# EAGLE design FBMiniLEDStrip (EAGLE 7.7.0)
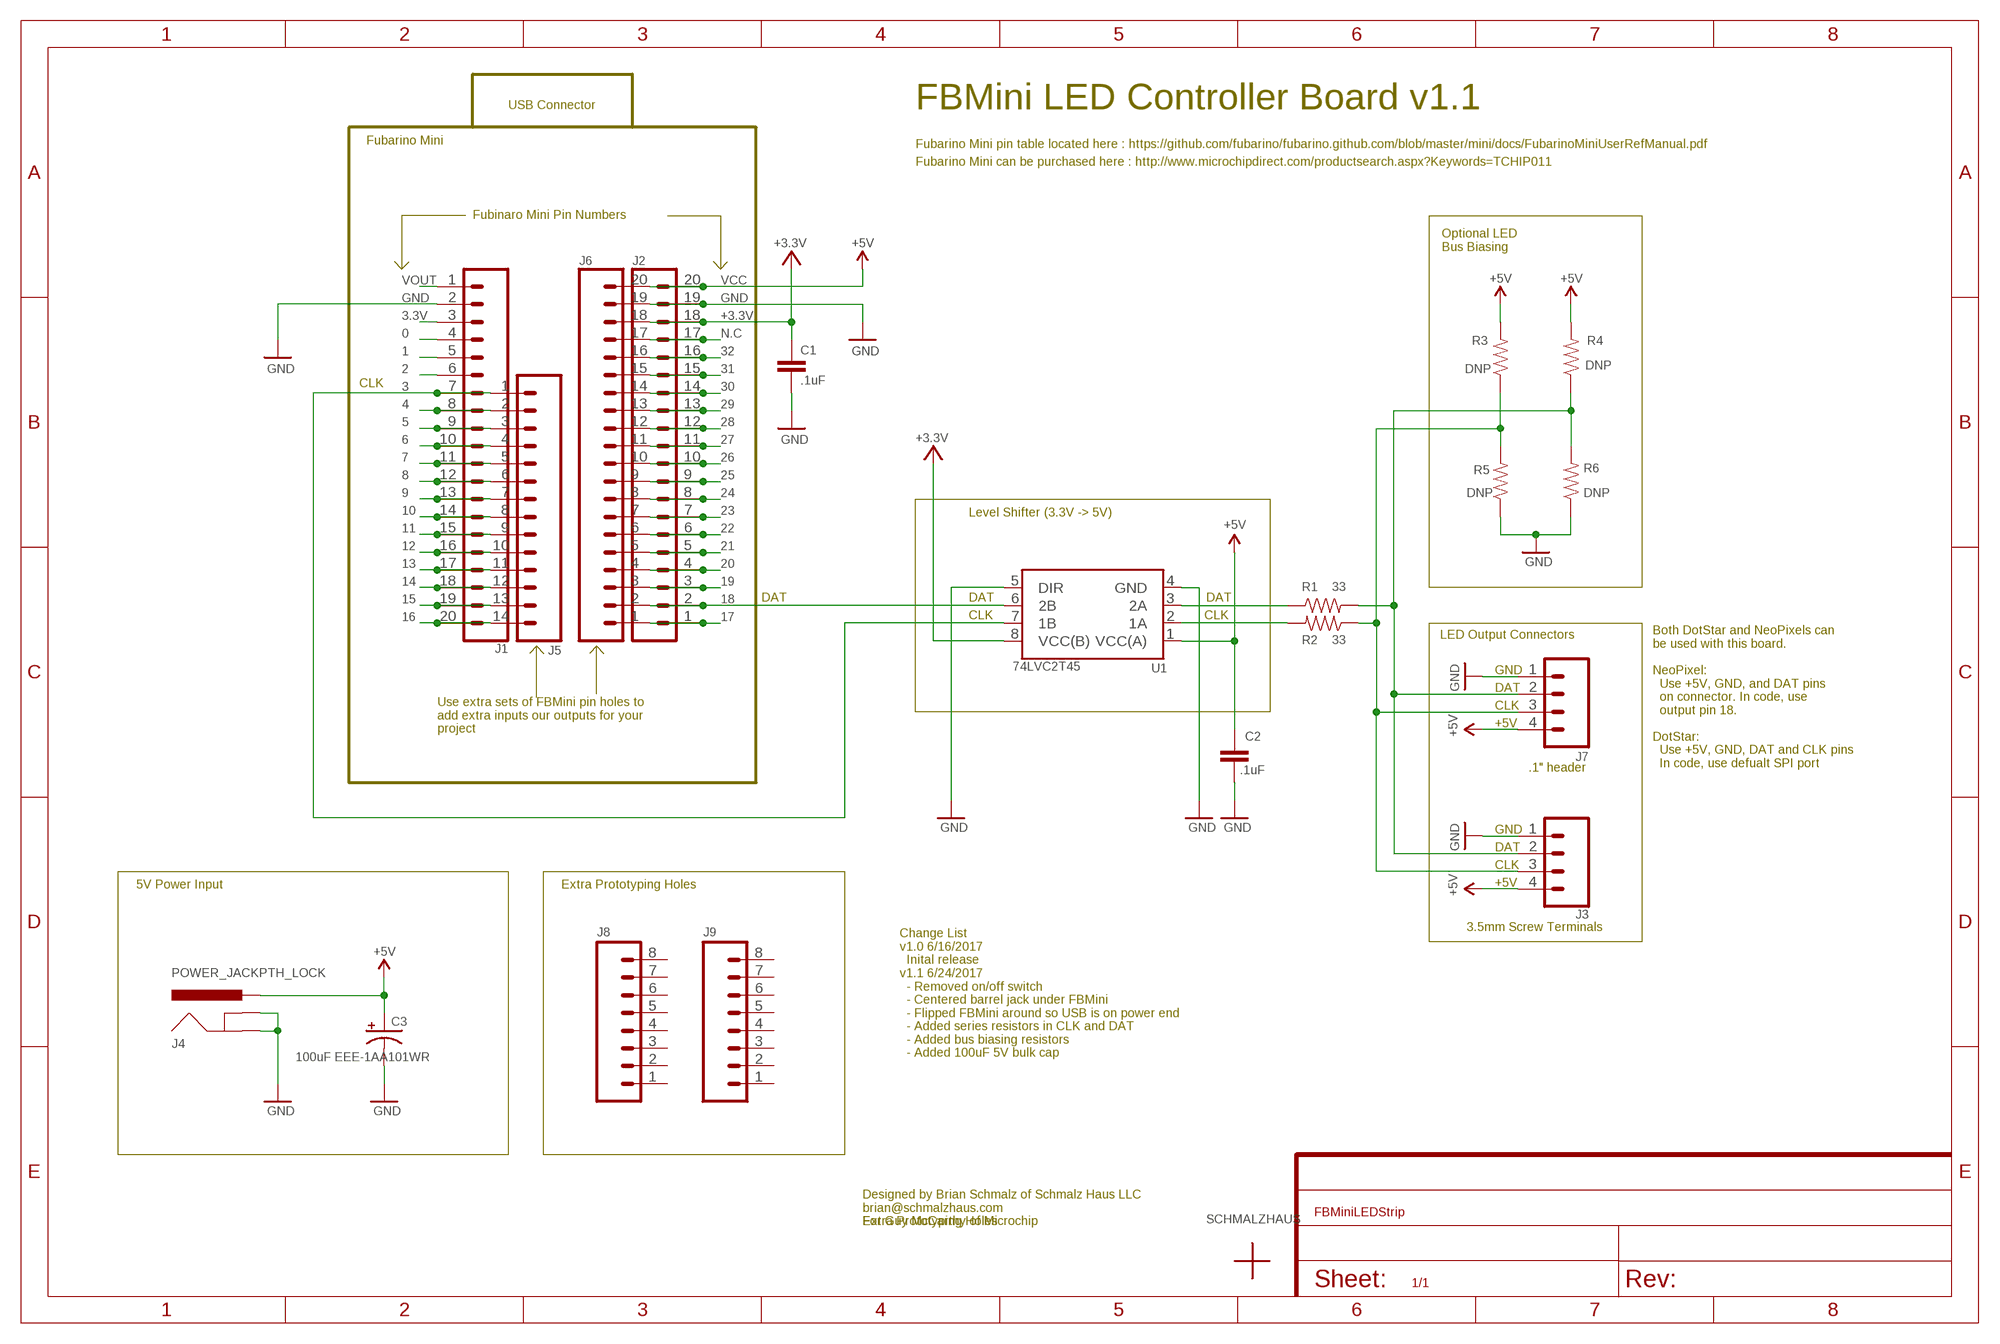
[diagram p0: schematic, sheet 1]

## Parts
C1  .1uF  CAP0603-CAP  [0603-CAP]
C2  .1uF  CAP0603-CAP  [0603-CAP]
C3  100uF EEE-1AA101WR  CAP_POLC  [PANASONIC_C]
J1  CONN_20  [1X20]
J2  CONN_20  [1X20]
J3  CONN_04SCREW  [SCREWTERMINAL-3.5MM-4@1]
J4  POWER_JACKPTH_LOCK  [POWER_JACK_PTH_LOCK]
J5  M14  [1X14]
J6  CONN_20  [1X20]
J7  M04PTH  [1X04]
J8  M08  [1X08_ROUND]
J9  M08  [1X08_ROUND]
R1  33  RESISTOR0603  [0603-RES]
R2  33  RESISTOR0603  [0603-RES]
R3  DNP  RESISTOR0603  [0603-RES]
R4  DNP  RESISTOR0603  [0603-RES]
R5  DNP  RESISTOR0603  [0603-RES]
R6  DNP  RESISTOR0603  [0603-RES]
U1  74LVC2T45  [VSSOP8]
U$1  SCHMALZHAUSSCHMALZHAUS_SMALL  [SCHMALZHAUS_SMALL]

## Nets
0: J1.4
1: J1.5
2: J1.6
3: J1.7 J5.1 U1.7(1B)
3.3V_: J1.3
4: J1.8 J5.2
5: J1.9 J5.3
6: J1.10 J5.4
7: J1.11 J5.5
8: J1.12 J5.6
9: J1.13 J5.7
10: J1.14 J5.8
11: J1.15 J5.9
12: J1.16 J5.10
13: J1.17 J5.11
14: J1.18 J5.12
15: J1.19 J5.13
16: J1.20 J5.14
17: J2.1 J6.1
18: J2.2 J6.2 U1.6(2B)
19: J2.3 J6.3
20: J2.4 J6.4
21: J2.5 J6.5
22: J2.6 J6.6
23: J2.7 J6.7
24: J2.8 J6.8
25: J2.9 J6.9
26: J2.10 J6.10
27: J2.11 J6.11
28: J2.12 J6.12
29: J2.13 J6.13
30: J2.14 J6.14
31: J2.15 J6.15
32: J2.16 J6.16
+3.3V: C1.1 J2.18 J6.18
+3V3: U1.8(VCC(B)) ; supply symbol labelled +3.3V
GND: C1.2 C2.1 C3.- J1.2 J2.19 J3.1 J4.GND J4.GNDBREAK J6.19 J7.1 R5.1 R6.1 U1.4(GND) U1.5(DIR)
N$2: J3.2 J7.2 R1.2 R4.1 R6.2
N$3: R2.2 U1.2(1A)
N$4: J3.3 J7.3 R2.1 R3.1 R5.2
N$23: R1.1 U1.3(2A)
N.C: J2.17 J6.17
VCC: C2.2 C3.+ J2.20 J3.4 J4.PWR J6.20 J7.4 R3.2 R4.2 U1.1(VCC(A)) ; supply symbol labelled +5V
VOUT: J1.1
Unconnected: J8.1 J8.2 J8.3 J8.4 J8.5 J8.6 J8.7 J8.8 J9.1 J9.2 J9.3 J9.4 J9.5 J9.6 J9.7 J9.8

## Notes on the sheet
- USB Connector | FBMini LED Controller Board v1.1
- Fubarino Mini | Fubarino Mini pin table located here : https://github.com/fubarino/fubarino.github.com/blob/master/mini/docs/FubarinoMiniUserRefManual.pdf
- Fubarino Mini can be purchased here : http://www.microchipdirect.com/productsearch.aspx?Keywords=TCHIP011
- Fubinaro Mini Pin Numbers
- Optional LED
  Bus Biasing
- CLK
- Level Shifter (3.3V -> 5V)
- DAT | DAT | DAT
- CLK | CLK
- LED Output Connectors
- GND
- DAT
- CLK
- +5V
- Use extra sets of FBMini pin holes to 
  add extra inputs our outputs for your
  project
- .1" header
- Both DotStar and NeoPixels can
  be used with this board.
  
  NeoPixel:
    Use +5V, GND, and DAT pins
    on connector. In code, use
    output pin 18.
  
  DotStar:
    Use +5V, GND, DAT and CLK pins
    In code, use defualt SPI port
- GND
- DAT
- CLK
- 5V Power Input | Extra Prototyping Holes | +5V
- 3.5mm Screw Terminals
- Change List
  v1.0 6/16/2017
    Inital release
  v1.1 6/24/2017
    - Removed on/off switch
    - Centered barrel jack under FBMini
    - Flipped FBMini around so USB is on power end
    - Added series resistors in CLK and DAT
    - Added bus biasing resistors
    - Added 100uF 5V bulk cap
- Extra Prototyping Holes
- Designed by Brian Schmalz of Schmalz Haus LLC
  brian@schmalzhaus.com
  For Guy McCarthy of Microchip

## Library data of the parts
C1 C2 = SparkFun-Capacitors:CAP: Capacitor Standard 0603 ceramic capacitor, and 0.1" leaded capacitor.
C3 = SparkFun-Capacitors:CAP_POL: Capacitor Polarized These are standard SMD and PTH capacitors. Normally 10uF, 47uF, and 100uF in electrolytic and tantalum varieties. Always verify the external diameter of the through hole cap, it varies with capacity, voltage, and manufacturer. The EIA devices should be standard.
J1 J2 J6 = SparkFun-Connectors:CONN_20: Multi connection point. Often used as Generic Header-pin footprint for 0.1 inch spaced/style header connections On any of the 0.1 inch spaced packages, you can populate with these: Break Away Headers - Straight <https://www.sparkfun.com/products/116> (PRT-00116) Break Away Male Headers - Right Angle <https://www.sparkfun.com/products/553> (PRT-00553) Female Headers <https://www.sparkfun.com/products/115> (PRT-00115) Break Away Headers - Machine Pin <https://www.sparkfun.com/products/117> (PRT-00117) Break Away Female Headers - Swiss Machine Pin <https://www.sparkfun.com/products/743> (PRT-00743) For SCREWTERMINALS and SPRING TERMINALS visit here: Screw Terimnals on SparkFun.com <https://www.sparkfun.com/search/results?term=Screw+Terminals> (5mm/3.5mm/2.54mm spacing) This device is also useful as a general connection point to wire up your design to another part of your project. Our various solder wires solder well into these plated through hole pads. Hook-Up Wire - Assortment (Stranded, 22 AWG) <https://www.sparkfun.com/products/11375> (PRT-11375) Hook-Up Wire - Assortment (Solid Core, 22 AWG) <https://www.sparkfun.com/products/11367> (PRT-11367) View the entire wire category on our website here <https://www.sparkfun.com/categories/141> Special notes: Molex polarized connector foot print use with SKU : PRT-08231 with associated crimp pins and housings. 1MM SMD Version SKU: PRT-10208 NOTES ON THE VARIANTS LOCK and LOCK_LONGPADS... This footprint was designed to help hold the alignment of a through-hole component (i.e. 6-pin header) while soldering it into place. You may notice that each hole has been shifted either up or down by 0.005 of an inch from it's more standard position (which is a perfectly straight line). This slight alteration caused the pins (the squares in the middle) to touch the edges of the holes. Because they are alternating, it causes a "brace" to hold the component in place. 0.005 has proven to be the perfect amount of "off-center" position when using our standard breakaway headers. Although looks a little odd when you look at the bare footprint, once you have a header in there, the alteration is very hard to notice. Also,if you push a header all the way into place, it is covered up entirely on the bottom side. Note about LOCK SPECIAL package: This is just like the LOCK variant in that the holes are staggared by 5 mil, but except for the last two holes. They are not altered from the "standard" footprint layout. This is used for a special purpose on the layout of our Graphic LCD Backpack. Make sure you want to use this device before selecting it for you project!
J3 = SparkFun-Connectors:CONN_04: Multi connection point. Often used as Generic Header-pin footprint for 0.1 inch spaced/style header connections On any of the 0.1 inch spaced packages, you can populate with these: Break Away Headers - Straight <https://www.sparkfun.com/products/116> (PRT-00116) Break Away Male Headers - Right Angle <https://www.sparkfun.com/products/553> (PRT-00553) Female Headers <https://www.sparkfun.com/products/115> (PRT-00115) Break Away Headers - Machine Pin <https://www.sparkfun.com/products/117> (PRT-00117) Break Away Female Headers - Swiss Machine Pin <https://www.sparkfun.com/products/743> (PRT-00743) For SCREWTERMINALS and SPRING TERMINALS visit here: Screw Terimnals on SparkFun.com <https://www.sparkfun.com/search/results?term=Screw+Terminals> (5mm/3.5mm/2.54mm spacing) This device is also useful as a general connection point to wire up your design to another part of your project. Our various solder wires solder well into these plated through hole pads. Hook-Up Wire - Assortment (Stranded, 22 AWG) <https://www.sparkfun.com/products/11375> (PRT-11375) Hook-Up Wire - Assortment (Solid Core, 22 AWG) <https://www.sparkfun.com/products/11367> (PRT-11367) View the entire wire category on our website here <https://www.sparkfun.com/categories/141> Special notes: Molex polarized connector foot print use with SKU : PRT-08231 with associated crimp pins and housings. 1MM SMD Version SKU: PRT-10208; PROD_ID: 2xCONN-08399; SF_ID: 2xPRT-08084
J4 = SparkFun-Connectors:POWER_JACK: Power Jack This is the standard 5.5mm barrel jack for power. The PTH is the most common, proven, reliable, footprint. The Slot footprint only works if the mill layer is transmitted to the PCB fab house so be warned. Mating wall wart : TOL-00298 (and others); PROD_ID: CONN-08197; SF_ID: PRT-00119
J5 = SparkFun-Connectors:M14: Header 14 Standard 14-pin 0.1" header. Use with straight break away headers (SKU : PRT-00116), right angle break away headers (PRT-00553), swiss pins (PRT-00743), machine pins (PRT-00117), and female headers (PRT-00115).
J7 = SparkFun-Connectors:M04: Header 4 Standard 4-pin 0.1" header. Use with straight break away headers (SKU : PRT-00116), right angle break away headers (PRT-00553), swiss pins (PRT-00743), machine pins (PRT-00117), and female headers (PRT-00115). Molex polarized connector foot print use with SKU : PRT-08231 with associated crimp pins and housings. 1MM SMD Version SKU: PRT-10208; PROD_ID: CONN-09696
J8 J9 = SparkFun-Connectors:M08: Header 8 Standard 8-pin 0.1" header. Use with straight break away headers (SKU : PRT-00116), right angle break away headers (PRT-00553), swiss pins (PRT-00743), machine pins (PRT-00117), and female headers (PRT-00115).; PROD_ID: CONN-08437
R1-R6 = SparkFun-Resistors:RESISTOR: Resistor Basic schematic elements and footprints for 0603, 1206, and PTH resistors.
U1 = 74LVCH2T45DC:74LVC2T45
U$1 = SchmalzHaus:SCHMALZHAUS

## Board
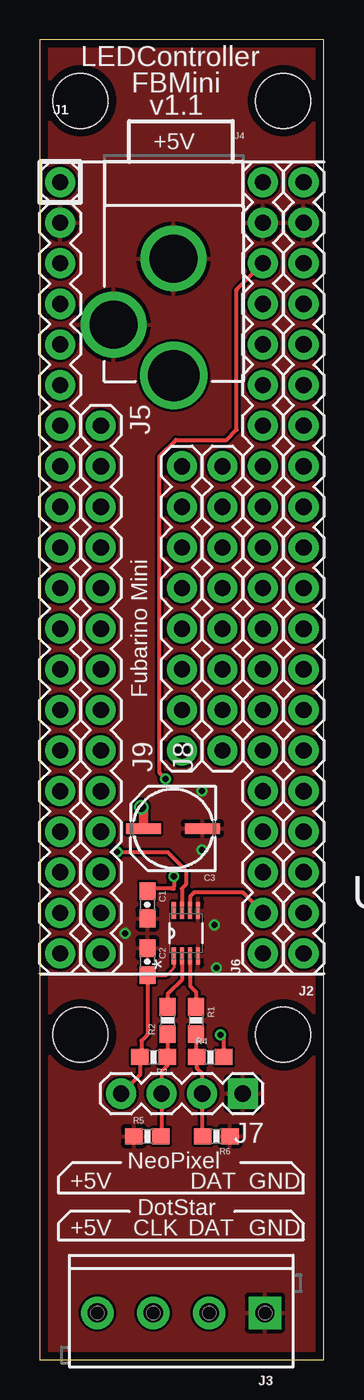
[diagram p1: board, top side]
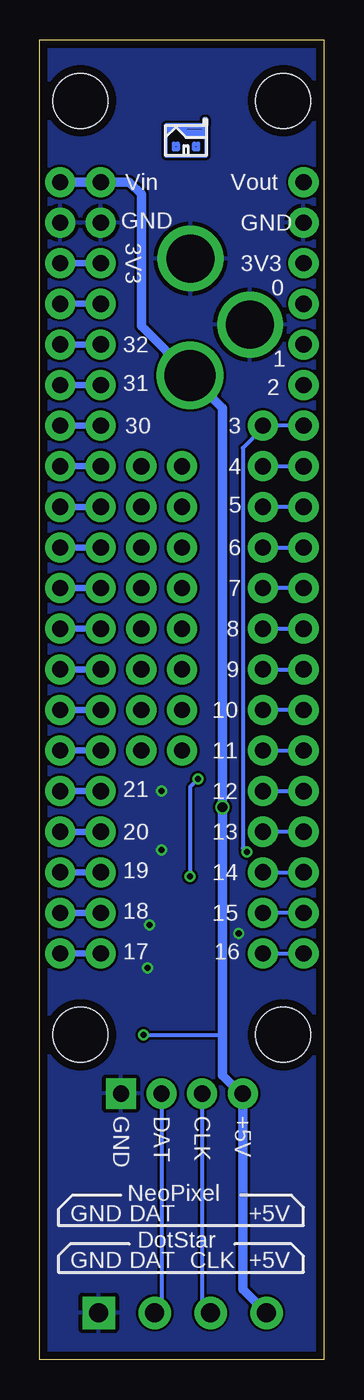
[diagram p2: board, bottom side, seen from below]

Size 17.78 x 82.55 mm. Coordinates in mm from the lower left corner, seen from the top.
Outline: 0,0 17.78,0 17.78,82.55 0,82.55 0,0
Copper layers (1*16): Top 0.035mm / dielectric 1.6mm / Bottom 0.035mm
Design rules "Elecrow_2-layer_PCB_eagle_rule": minimum track width 6mil, minimum drill 12mil, track to track 6mil, track to pad 6mil, pad to pad 6mil, via to via 8mil, smd to smd 0mil, copper to edge 20mil, drill to drill 10mil, minimum pad ring 6mil, minimum via ring 6mil, stop-mask expansion 0mil, vias tented up to drill 100mil, thermal gap 10mil
Holes 3.43 mm at 2.54,78.74 15.24,78.74 2.54,20.32 15.24,20.32

### Footprints (pad centres in the part's own frame; a part is rotated, then mirrored left to right if it is on the bottom)
0603-CAP = smd 1.1 x 1: 1 -0.85,0; 2 0.85,0
PANASONIC_C = smd 2.2 x 0.65: + 1.9,-0.2; - -1.8,-0.2
1X20 = drill 1.016 pad 1.88: 1 0,0; 2 2.54,0; 3 5.08,0; 4 7.62,0; 5 10.16,0; 6 12.7,0; 7 15.24,0; 8 17.78,0; 9 20.32,0; 10 22.86,0; 11 25.4,0; 12 27.94,0; 13 30.48,0; 14 33.02,0; 15 35.56,0; 16 38.1,0; 17 40.64,0; 18 43.18,0; 19 45.72,0; 20 48.26,0
SCREWTERMINAL-3.5MM-4@1 = drill 1.2 pad 2.032 square: 1 0,0 | drill 1.2 pad 2.032: 2 3.5,0; 3 7,0; 4 10.5,0
POWER_JACK_PTH_LOCK = drill 2.997 pad 4.115: GND 0.025,6.557; GNDBREAK 3.762,10.7 | drill 3.2 pad 4.115: PWR 0,13.878
1X14 = drill 1.016 pad 1.88: 1 0,0; 2 2.54,0; 3 5.08,0; 4 7.62,0; 5 10.16,0; 6 12.7,0; 7 15.24,0; 8 17.78,0; 9 20.32,0; 10 22.86,0; 11 25.4,0; 12 27.94,0; 13 30.48,0; 14 33.02,0
1X04 = drill 1.016 pad 1.88 square: 1 0,0 | drill 1.016 pad 1.88: 2 2.54,0; 3 5.08,0; 4 7.62,0
1X08_ROUND = drill 1.016 pad 1.88: 1 0,0; 2 2.54,0; 3 5.08,0; 4 7.62,0; 5 10.16,0; 6 12.7,0; 7 15.24,0; 8 17.78,0
0603-RES = smd 1.1 x 1: 1 -0.85,0; 2 0.85,0
VSSOP8 = smd 1.067 x 0.254: 1 -1.422,0.762; 2 -1.422,0.254; 3 -1.422,-0.254; 4 -1.422,-0.762; 5 1.422,-0.762; 6 1.422,-0.254; 7 1.422,0.254; 8 1.422,0.762

### Placement (x,y rotation side)
C1  6.73,28.45 270 top
C2  6.73,24.89 270 top
C3  8.38,33.02 180 top
J1  1.27,73.66 270 top
J2  16.51,25.4 90 top
J3  14.1,2.92 180 top
J4  8.38,75.44 180 top
J5  3.81,58.42 270 top
J6  13.97,25.4 90 top
J7  12.7,16.64 180 top
J8  11.43,38.1 90 top
J9  8.89,38.1 90 top
R1  9.78,21.21 270 top
R2  8,21.21 90 top
R3  7.11,18.92 180 top
R4  10.67,18.92 0 top
R5  6.73,13.97 0 top
R6  11.05,13.97 180 top
U1  9.14,26.67 90 top
U$1  8.64,75.31 0 bottom

### Tracks (layer width: path | path; a pad name or v marks a point on that pad's centre or on a via)
3  (via drill 0.38)
  Top 0.254: v4.83,31.75 8,31.75 9.14,30.61 9.14,29.72 8.89,29.46 U1.7
  Bottom 0.254: J1.7 J5.1 3.81,58.29 5.08,57.02 5.08,32 v4.83,31.75
4
  Bottom 0.254: J5.2 J1.8
5
  Bottom 0.254: J1.9 J5.3
6
  Bottom 0.254: J5.4 J1.10
7
  Bottom 0.254: J1.11 J5.5
8
  Bottom 0.254: J5.6 J1.12
9
  Bottom 0.254: J5.7 J1.13
10
  Bottom 0.254: J1.14 J5.8
11
  Bottom 0.254: J5.9 J1.15
12
  Bottom 0.254: J5.10 J1.16
13
  Bottom 0.254: J1.17 J5.11
14
  Bottom 0.254: J5.12 J1.18
15
  Bottom 0.254: J1.19 J5.13
16
  Bottom 0.254: J5.14 J1.20
17
  Bottom 0.406: J6.1 J2.1
18
  Top 0.254: J6.2 12.7,29.21 9.65,29.21 9.4,28.96 U1.6
  Bottom 0.406: J6.2 J2.2
19
  Bottom 0.406: J6.3 J2.3
20
  Bottom 0.406: J6.4 J2.4
21
  Bottom 0.406: J6.5 J2.5
22
  Bottom 0.406: J6.6 J2.6
23
  Bottom 0.406: J6.7 J2.7
24
  Bottom 0.406: J6.8 J2.8
25
  Bottom 0.406: J6.9 J2.9
26
  Bottom 0.406: J6.10 J2.10
27
  Bottom 0.406: J6.11 J2.11
28
  Bottom 0.406: J6.12 J2.12
29
  Bottom 0.406: J6.13 J2.13
30
  Bottom 0.406: J6.14 J2.14
31
  Bottom 0.406: J6.15 J2.15
32
  Bottom 0.406: J6.16 J2.16
+3.3V  (via drill 0.38)
  Top 0.203: 6.64,29.21 C1.1
  Top 0.254: v7.87,36.32 7.49,36.7 7.49,56.52 8.51,57.53 11.68,57.53 12.32,58.17 12.32,66.93 J6.18 | 8.38,29.46 8.26,29.46 | 8.26,29.46 6.9,29.46 C1.1 | v8.38,30.23 8.38,29.59 8.26,29.46
  Bottom 0.254: v7.87,36.32 8.38,35.81 v8.38,30.23
  Bottom 0.406: J6.18 J2.18
GND  (via drill 0.38)
  other vias: 10.16,35.56 10.16,31.88 10.92,27.18 11.05,24.51 5.33,26.67
  pour Top: 0,82.55 17.78,82.55 17.78,0 0,0
  pour Bottom: 0,82.55 17.78,82.55 17.78,0 0,0
N$2
  Top 0.254: R1.2 9.78,18.96 R4.1 9.82,18.25 10.16,17.91 J7.2 10.16,14.01 R6.2
  Bottom 0.254: J7.2 10.16,3.36 J3.2
N$3
  Top 0.254: 8,21.84 R2.2 8,22.86 8.89,23.75 U1.2
N$4
  Top 0.254: R2.1 8,18.96 R3.1 7.96,18.38 7.62,18.03 J7.3 7.62,14.01 R5.2
  Bottom 0.254: J7.3 7.62,3.44 J3.3
N$23
  Top 0.254: 9.4,22.1 9.65,21.84 9.78,21.97 R1.1 9.78,22.99 9.4,23.37 U1.3
N.C
  Bottom 0.406: J6.17 J2.17
VCC  (via drill 0.38, 0.6)
  Top 0.203: C2.2 7.91,24.04 8.38,24.51 U1.1
  Top 0.254: J7.4 6.26,17.82 R3.2 6.35,19.01 6.35,19.94 6.73,20.32 C2.2 | R4.2 11.52,20.11 v11.3,20.32
  Top 0.61: C3.+ 6.48,34.41 v6.35,34.54
  Bottom 0.254: 5.08,16.51 J7.4 | v11.3,20.32 6.35,20.32
  Bottom 0.406: J4.PWR 8.38,61.59
  Bottom 0.61: 8.38,61.59 11.43,64.64 11.43,72.9 12.19,73.66 J6.20 J2.20 | J4.PWR 6.35,59.53 v6.35,34.54 6.35,20.32 6.35,17.78 5.08,16.51 5.08,4.4 J3.4

### Text on the board
tPlace: LEDController | FBMini | v1.1 | +5V | Fubarino Mini | NeoPixel | +5V | DAT | GND | DotStar | +5V | CLK | DAT | GND
bPlace: Vout | Vin | GND | GND | 3V3 | 3V3 | 0 | 32 | 1 | 31 | 2 | 3 | 30 | 4 | 5 | 6 | 7 | 8 | 9 | 10 | 11 | 12 | 21 | 13 | 20 | 14 | 19 | 18 | 15 | 16 | 17 | +5V | CLK | DAT | GND | NeoPixel | +5V | DAT | GND | DotStar | +5V | CLK | DAT | GND